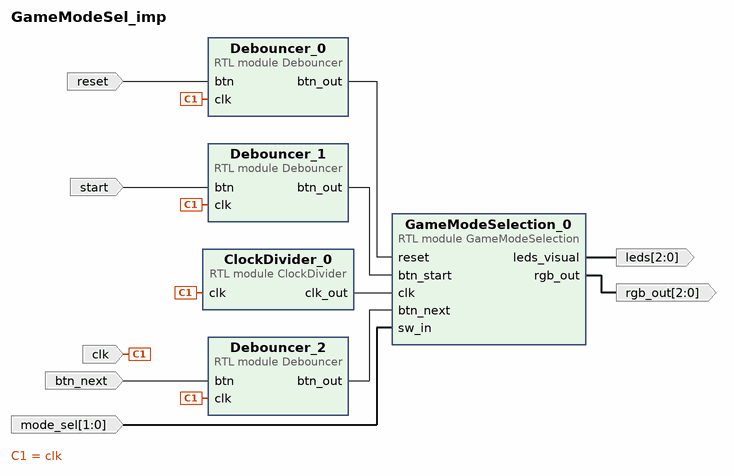
[diagram p0: block diagram of the top level]
# Vivado block design GameModeSel_imp, xc7z010clg400-1, Vivado 2020.1
create_bd_design GameModeSel_imp

create_bd_port -dir I -type clk clk
set_property -dict {CONFIG.FREQ_HZ 125000000} [get_bd_ports clk]
create_bd_port -dir I reset
create_bd_port -dir I start
create_bd_port -dir I btn_next
create_bd_port -dir O -from 2 -to 0 leds
create_bd_port -dir O -from 2 -to 0 rgb_out
create_bd_port -dir I -from 1 -to 0 mode_sel

create_bd_cell -type module -reference GameModeSelection GameModeSelection_0
create_bd_cell -type module -reference Debouncer Debouncer_0
create_bd_cell -type module -reference Debouncer Debouncer_1
create_bd_cell -type module -reference Debouncer Debouncer_2
create_bd_cell -type module -reference ClockDivider ClockDivider_0
set_property -dict {CONFIG.FREQ_DES 100} [get_bd_cells ClockDivider_0]

# ---- connections ----

connect_bd_net [get_bd_pins Debouncer_0/btn_out] [get_bd_pins GameModeSelection_0/reset]
connect_bd_net [get_bd_pins Debouncer_1/btn_out] [get_bd_pins GameModeSelection_0/btn_start]
connect_bd_net [get_bd_pins Debouncer_2/btn_out] [get_bd_pins GameModeSelection_0/btn_next]
connect_bd_net [get_bd_ports clk] \
  [get_bd_pins Debouncer_0/clk] [get_bd_pins Debouncer_1/clk] [get_bd_pins Debouncer_2/clk] [get_bd_pins ClockDivider_0/clk]
connect_bd_net [get_bd_pins ClockDivider_0/clk_out] [get_bd_pins GameModeSelection_0/clk]
connect_bd_net [get_bd_ports reset] [get_bd_pins Debouncer_0/btn]
connect_bd_net [get_bd_ports start] [get_bd_pins Debouncer_1/btn]
connect_bd_net [get_bd_ports btn_next] [get_bd_pins Debouncer_2/btn]
connect_bd_net [get_bd_pins GameModeSelection_0/leds_visual] [get_bd_ports leds]
connect_bd_net [get_bd_pins GameModeSelection_0/rgb_out] [get_bd_ports rgb_out]
connect_bd_net [get_bd_ports mode_sel] [get_bd_pins GameModeSelection_0/sw_in]

validate_bd_design
save_bd_design
